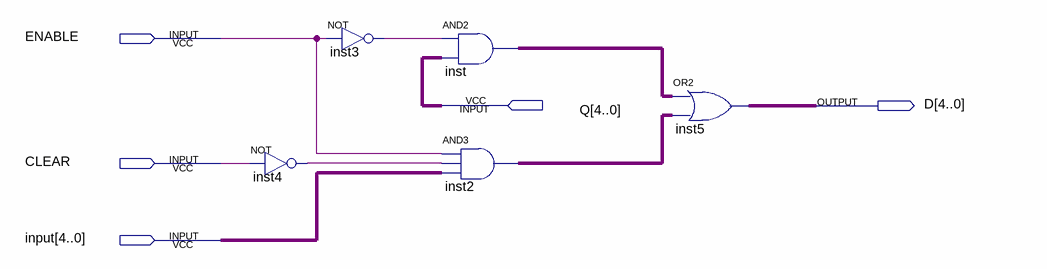
[diagram p0: schematic sheet]
// Quartus schematic enable-clear.bdf as structural Verilog: 5 symbols, 5 pins
module \enable-clear  (
  input  ENABLE,
  input  [4:0] Q,
  input  CLEAR,
  input  [4:0] \input ,
  output [4:0] D
);

  wire inst3_out, inst4_out;
  wire [4:0] inst2_out, inst_out;

  not inst4 (inst4_out, CLEAR);
  not inst3 (inst3_out, ENABLE);
  assign inst_out = {5{inst3_out}} & Q;  // AND2 inst, 5 bits wide
  assign inst2_out = {5{ENABLE}} & {5{inst4_out}} & \input ;  // AND3 inst2, 5 bits wide
  assign D = inst_out | inst2_out;  // OR2 inst5, 5 bits wide
endmodule
